# Altium schematic sheet TIDA-010967_QSPI_Flash.SchDoc: QSPI_FLASH
size 431 x 279 mm; Date: Not shown in title block; ApprovedBy: Not shown in title block; CheckedBy: Not shown in title block; Author: Not shown in title block; CompanyName: Not shown in title block; DrawnBy: Justin Yin; Engineer: Not shown in title block; Organization: Not shown in title block; Address1: Not shown in title block; Address2: Not shown in title block; Address3: Not shown in title block; Address4: Not shown in title block; DocumentNumber: 7; Revision: Use project parameter SCH_Rev; SheetNumber: 7; SheetTotal: 8; PageSetup: Record=PageOptions|CenterHorizontal=True|CenterVertical=True|PrintScale=1.00|XCorrection=1.00|YCorrection=1.00|PrintKind=0|BorderSize=5000000|LeftOffset=0|BottomOffset=0|Orientation=2|PaperLength=1000|PaperWidth=1000|Scale=100|PaperSource=15|PrintQuality=600|MediaType=1|DitherType=10|PaperKind=Letter|PrintScaleMode=1; CurrentTime: Not shown in title block; CurrentDate: Not shown in title block; Time: Not shown in title block; DocumentFullPathAndName: Not shown in title block; DocumentName: Not shown in title block; ModifiedDate: Not shown in title block; ImagePath: Not shown in title block
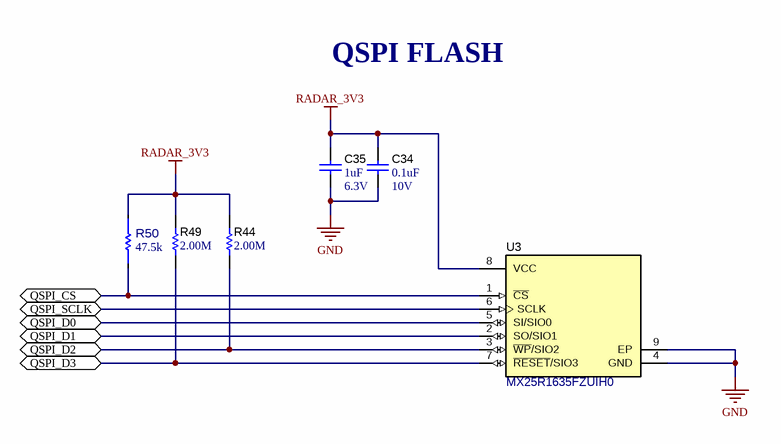
[diagram p0: TIDA-010967_QSPI_Flash.SchDoc]

## Parts
C34  Value2: 10V  ValueDisplayed: 0.1uF  [0201]  (hidden comment: GRM033C71A104KE14D)
C35  VDC_V: 6.3V  ValueDisplayed: 1uF  [0402L]  (hidden comment: GRM155R70J105KA12D)
R44  ValueDisplayed: 2.00M  [0402]  (hidden comment: CRCW04022M00FKED)
R49  ValueDisplayed: 2.00M  [0402]  (hidden comment: CRCW04022M00FKED)
R50  Res_ohm: 47.5k  [FP-AC0402FR-0747K5L_0402-MFG]  (hidden comment: AC0402FR-0747K5L)
U3  MX25R1635FZUIH0  [USON-8L]

## Ports
QSPI_CS (bidir), QSPI_D0 (bidir), QSPI_D1 (bidir), QSPI_D2 (bidir), QSPI_D3 (bidir), QSPI_SCLK (bidir)

## Nets
GND: C34.1 C35.2 U3.4(GND) U3.9(EP)
RADAR_3V3: C34.2 C35.1 R44.2 R49.2 R50.1 U3.8(VCC)
QSPI_CS: R50.2 U3.1(~{CS}) ; port QSPI_CS
QSPI_D0: U3.5(SI/SIO0) ; port QSPI_D0
QSPI_D1: U3.2(SO/SIO1) ; port QSPI_D1
QSPI_D2: R44.1 U3.3(~{WP}/SIO2) ; port QSPI_D2
QSPI_D3: R49.1 U3.7(~{RESET}/SIO3) ; port QSPI_D3
QSPI_SCLK: U3.6(SCLK) ; port QSPI_SCLK

## Notes on the sheet
- QSPI FLASH
- Drawn By:
- SVN Rev:
- Number:
- TID #:
- Orderable:
- Rev:
- Sheet Title:
- File:
- Project Title:
- Designed for:
- Assembly Variant:
- Mod. Date:
- Sheet:
- Size:
- of
- B
- http://www.ti.com
- Texas Instruments and/or its licensors do not warrant the accuracy or completeness of this specification or any information contained therein. Texas Instruments and/or its licensors do not warrant that this design will meet the specifications, will be suitable for your application or fit for any particular purpose, or will operate in an implementation. Texas Instruments and/or its licensors do not warrant that the design is production worthy. You should completely validate and test your design implementation to confirm the system functionality for your application.
- Engineer:
- Contact:
- © Texas Instruments

## Library data of the parts
C34 = CMP-0064969-1: CAP, CERM, 0.1 uF, 10 V,+/- 10%, X7S, 0201; Manufacturer: MuRata; TaMin_C: -55°C; Polarized: N; SizeAreaWB_mm2: 2.08; Value1: Unknown; U/M: EA; Value: 0.1uF; TaMax_C: 125°C; SizeZ_mm: 0.26; SizeX_mm: 0.6; SizeY_mm: 0.3; SizeArea_mm2: 0.18; Cap_F: 100nF; AEC Category: Q200; ComponentLink1URL: http://search.murata.co.jp/Ceramy/image/img/A01X/G101/ENG/GRM033C71A104KE14-01.pdf; Supplier Part Number 2: 81-GRM033C71A104KE4D; Publisher: Texas Instruments; Supplier 2: Mouser; TempCo: X7S; Published: 2008-06-19; RoHS: Y; MountType: SMT; Supplier 1: Digi-Key; PackageReference: 0201; Tolerance_%: 10%; Cap_Case: 0201; CompType: Capacitor; LatestRevisionDate: 2017-06-05; PartNumber: GRM033C71A104KE14D; AEC Qualified: N; VDC_V: 10V; ComponentLink1Description: Datasheet link; AEC Grade: N/A; Supplier Part Number 1: 490-14450-1-ND; Technology: Ceramic
C35 = CMP-0064947-2: CAP, CERM, 1 uF, 6.3 V,+/- 10%, X7R, 0402; Manufacturer: MuRata; TaMin_C: -55°C; Polarized: N; SizeAreaWB_mm2: 3; Value1: Unknown; U/M: EA; Value: 1uF; TaMax_C: 125°C; SizeZ_mm: 0.6; SizeX_mm: 1; SizeY_mm: 0.5; Cap_Case: 0402; Cap_F: 1µF; AEC Category: Q200; Supplier Part Number 2: 81-GRM155R70J105KA2D; Publisher: Texas Instruments; Supplier 2: Mouser; Supplier Part Number 3: 2688505RL; TempCo: X7R; Supplier 3: Farnell; Published: 2008-06-19; RoHS: Y; MountType: SMT; Supplier 1: Digi-Key; PackageReference: 0402; Tolerance_%: 10%; Value2: 6.3V; SizeArea_mm2: 0.5; CompType: Capacitor; LatestRevisionDate: 2017-06-05; PartNumber: GRM155R70J105KA12D; AEC Qualified: N; ComponentLink1Description: Datasheet link; AEC Grade: N/A; Supplier Part Number 1: 490-10024-1-ND; Technology: Ceramic; ComponentLink1URL: http://search.murata.co.jp/Ceramy/image/img/A01X/G101/ENG/GRM155R70J105KA12-01.pdf
R44 R49 = CMP-0026245-2: RES, 2.00 M, 1%, 0.063 W, AEC-Q200 Grade 0, 0402; Manufacturer: Vishay-Dale; Power_W: 63mW; TempCo: 100 ppm/C; Value_Code: 2M00; Value: 2.00Meg; EIA_Code: E96; Res_ohm: 2M; SizeX_mm: 1; SizeY_mm: 0.5; SizeZ_mm: 0.6; Value2: 0.063W; AEC Qualified: Y; VDC_V: 50V; AEC Category: Q200; AEC Grade: 0; ComponentLink1URL: http://www.vishay.com/docs/20035/dcrcwe3.pdf; Supplier Part Number 2: 52K6816; Supplier 2: Newark; Supplier Part Number 3: 71-CRCW0402-2M-E3; Supplier 3: Mouser; RoHS: E; Value1: 1%; MountType: SMT; Supplier 1: Digi-Key; PackageReference: 0402; Tolerance_%: 1%; SizeArea_mm2: 0.5; CompType: Resistor; PartNumber: CRCW04022M00FKED; ComponentLink1Description: Datasheet link; Supplier Part Number 1: 541-2.00MLCT-ND; Technology: Thick Film
R50 = CMP-0095013-1: Res Thick Film 0402 47.5K Ohm 1% 1/16W ±100ppm/°C Molded SMD Paper T/R; Manufacturer: Yageo; VDC_V: 50V; SizeZ_mm: 0.37mm; AEC Grade: Grade 0; Power_W: 62.5mW; AEC Qualified: Yes; Digikey Part Number: 13-AC0402FR-0747K5LCT-ND; Supplier 1: Digikey; Technology: Thick Film; ComponentLink1URL: https://www.yageo.com/upload/media/product/productsearch/datasheet/rchip/PYu-AC_51_RoHS_L_8.pdf; Tolerance_%: 1%; Mouser Part Number: 603-AC0402FR-0747K5L; Part Number: AC0402FR-0747K5L; RoHS: TRUE; Value: 47.5k; datasheet: https://www.yageo.com/upload/media/product/productsearch/datasheet/rchip/PYu-AC_51_RoHS_L_8.pdf; Supplier Part Number 2: 603-AC0402FR-0747K5L; Lead Free: Yes; helpURL: https://upverter.com/upn/revision/53eb058114c18d9e/; TempCo: 100ppm/°C; Supplier Part Number 1: 13-AC0402FR-0747K5LCT-ND; PackageReference: 0402; Operating Temperature Range: -55°C to +155°C; Series: AC; Mouser Description: Thick Film Resistors - SMD 1/16W 47.5K ohm 1% AEC-Q200; Supplier 2: Mouser; Datasheet Path: datasheets/Res-AC0402FR-0747K5L.pdf; ComponentLink1Description: Datasheet; Digikey Description: RES SMD 47.5K OHM 1% 1/16W 0402; PartNumber: AC0402FR-0747K5L
U3 = CMP-0078466-1: ULTRA LOW POWER, 16M-BIT [x 1/x 2/x 4] CMOS MXSMIO (SERIAL MULTI I/O) FLASH MEMORY, SON-8; Manufacturer: Macronix International Co., LTD; SizeArea_mm2: 6; SizeAreaWB_mm2: 12; SizeY_mm: 2; SizeZ_mm: 0.6; SizeX_mm: 3; PartNumber: MX25R1635FZUIH0; PackageReference: SON-8; Supplier Part Number 1: 1092-1178-1-ND; ComponentLink1Description: Datasheet URL; MountType: SMT; ComponentLink1URL: http://www.macronix.com/Lists/Datasheet/Attachments/6257/MX25R1635F,%20Wide%20Range,%2016Mb,%20v1.5.pdf; Supplier 1: Digi-Key; RoHS: Y